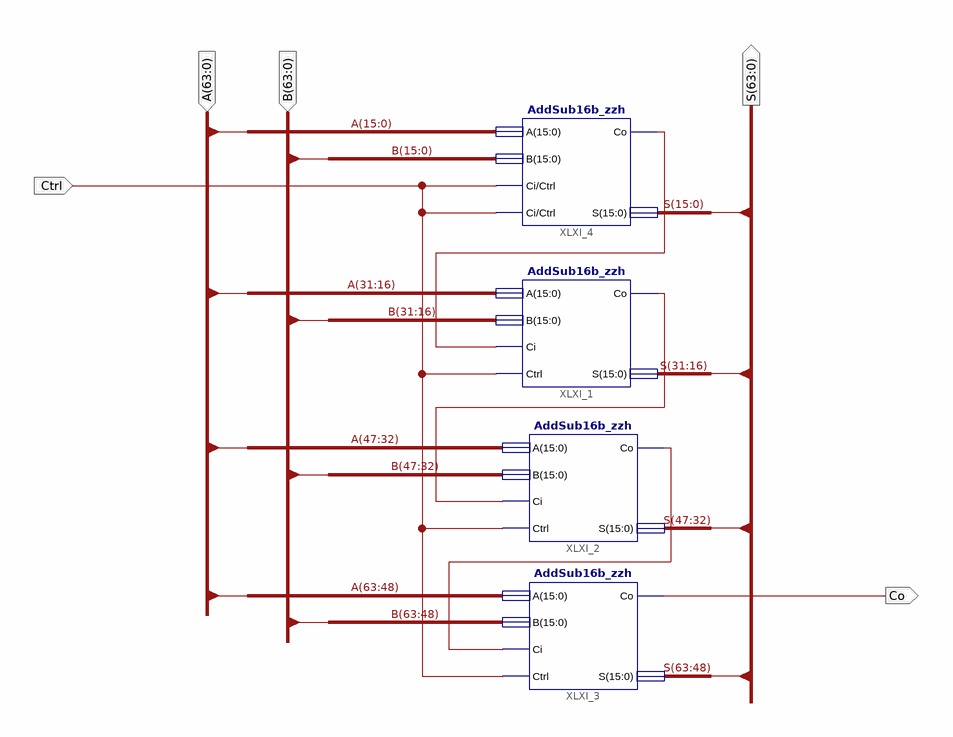
[diagram p0: schematic sheet 1]
// Xilinx ISE schematic AddSub64b_zzh.sch (kintex7) as structural Verilog: 4 symbols, 5 ports
module AddSub64b_zzh (
  input  [63:0] A,
  input  [63:0] B,
  input  Ctrl,
  output [63:0] S,
  output Co
);

  wire XLXN_1, XLXN_2, XLXN_3;

  AddSub16b_zzh XLXI_4 (.A(A[15:0]), .B(B[15:0]), .Ci(Ctrl), .Ctrl(Ctrl), .Co(XLXN_3), .S(S[15:0]));
  AddSub16b_zzh XLXI_1 (.A(A[31:16]), .B(B[31:16]), .Ci(XLXN_3), .Ctrl(Ctrl), .Co(XLXN_1), .S(S[31:16]));
  AddSub16b_zzh XLXI_3 (.A(A[63:48]), .B(B[63:48]), .Ci(XLXN_2), .Ctrl(Ctrl), .Co(Co), .S(S[63:48]));
  AddSub16b_zzh XLXI_2 (.A(A[47:32]), .B(B[47:32]), .Ci(XLXN_1), .Ctrl(Ctrl), .Co(XLXN_2), .S(S[47:32]));
endmodule
